# Altium schematic sheet RS485 Outputs.SchDoc: RS485 Outputs
size 292 x 193 mm; SheetNumber: 17; SheetTotal: 38
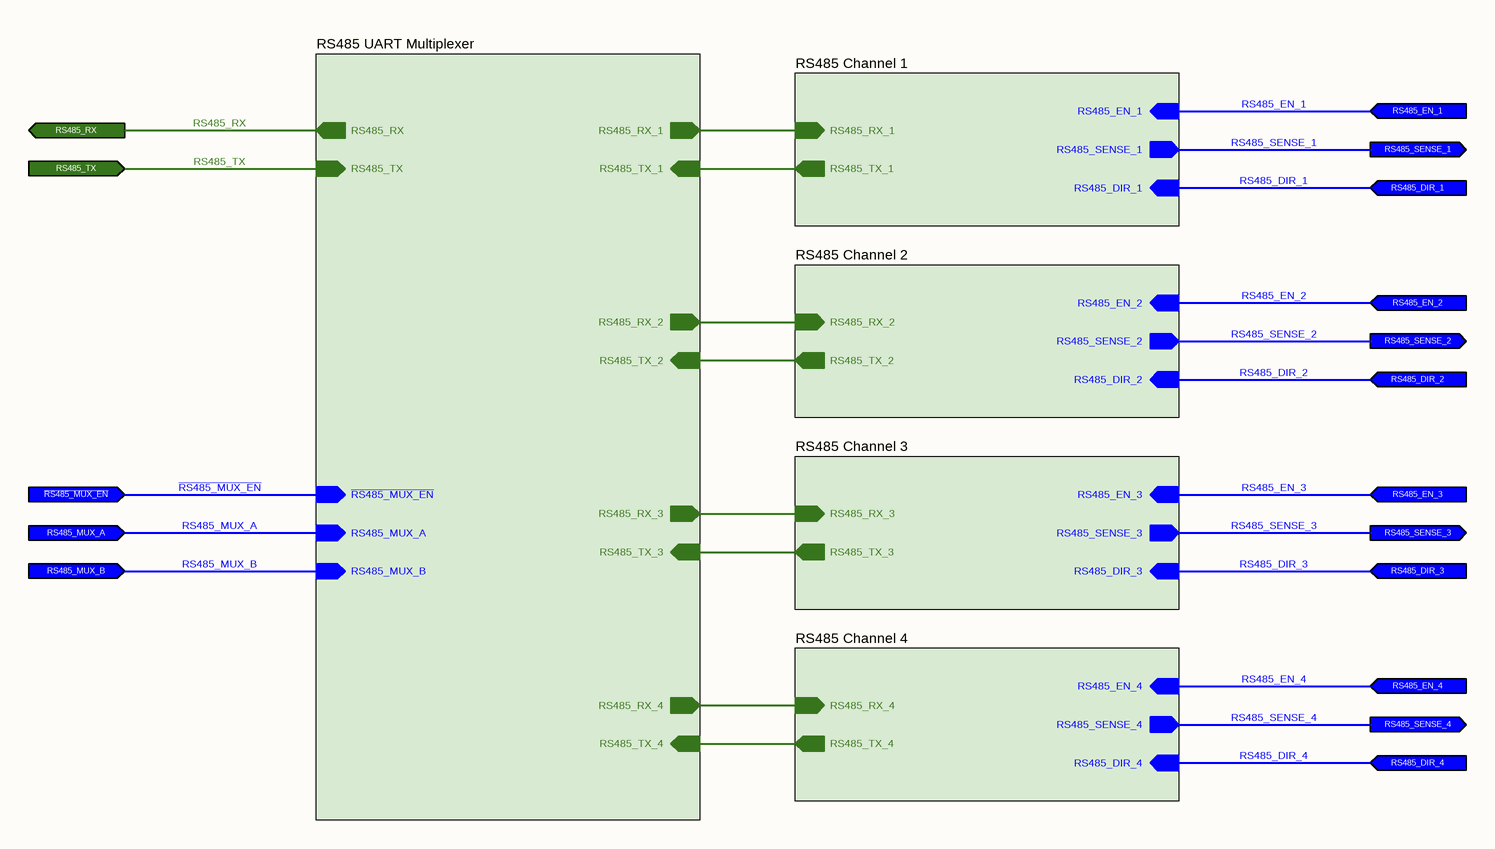
[diagram p0: RS485 Outputs.SchDoc]

## Sub-sheets
RS485 Channel 1 = RS485 Channel 1.SchDoc: RS485_TX_1 (out), RS485_RX_1 (in), RS485_EN_1 (in), RS485_SENSE_1 (out), RS485_DIR_1 (in)
RS485 Channel 2 = RS485 Channel 2.SchDoc: RS485_TX_2 (out), RS485_RX_2 (in), RS485_EN_2 (in), RS485_SENSE_2 (out), RS485_DIR_2 (in)
RS485 Channel 3 = RS485 Channel 3.SchDoc: RS485_TX_3 (out), RS485_RX_3 (in), RS485_EN_3 (in), RS485_SENSE_3 (out), RS485_DIR_3 (in)
RS485 Channel 4 = RS485 Channel 4.SchDoc: RS485_TX_4 (out), RS485_RX_4 (in), RS485_EN_4 (in), RS485_SENSE_4 (out), RS485_DIR_4 (in)
RS485 UART Multiplexer = RS485 UART Multiplexer.SchDoc: RS485_TX_1 (in), RS485_TX_3 (in), RS485_RX_2 (out), RS485_MUX_A (in), RS485_TX_2 (in), RS485_MUX_B (in), RS485_RX_1 (out), ~{RS485_MUX_EN} (in), RS485_TX (in), RS485_RX_3 (out), RS485_RX (out), RS485_RX_4 (out), RS485_TX_4 (in)

## Ports
RS485_DIR_1 (in), RS485_DIR_2 (in), RS485_DIR_3 (in), RS485_DIR_4 (in), RS485_EN_1 (in), RS485_EN_2 (in), RS485_EN_3 (in), RS485_EN_4 (in), RS485_MUX_A (in), RS485_MUX_B (in), RS485_RX (out), RS485_SENSE_1 (out), RS485_SENSE_2 (out), RS485_SENSE_3 (out), RS485_SENSE_4 (out), RS485_TX (in), ~{RS485_MUX_EN} (in)

## Nets
~{RS485_MUX_EN}: port ~{RS485_MUX_EN}, sheet RS485 UART Multiplexer/~{RS485_MUX_EN}
RS485_DIR_1: port RS485_DIR_1, sheet RS485 Channel 1/RS485_DIR_1
RS485_DIR_2: port RS485_DIR_2, sheet RS485 Channel 2/RS485_DIR_2
RS485_DIR_3: port RS485_DIR_3, sheet RS485 Channel 3/RS485_DIR_3
RS485_DIR_4: port RS485_DIR_4, sheet RS485 Channel 4/RS485_DIR_4
RS485_EN_1: port RS485_EN_1, sheet RS485 Channel 1/RS485_EN_1
RS485_EN_2: port RS485_EN_2, sheet RS485 Channel 2/RS485_EN_2
RS485_EN_3: port RS485_EN_3, sheet RS485 Channel 3/RS485_EN_3
RS485_EN_4: port RS485_EN_4, sheet RS485 Channel 4/RS485_EN_4
RS485_MUX_A: port RS485_MUX_A, sheet RS485 UART Multiplexer/RS485_MUX_A
RS485_MUX_B: port RS485_MUX_B, sheet RS485 UART Multiplexer/RS485_MUX_B
RS485_RX: port RS485_RX, sheet RS485 UART Multiplexer/RS485_RX
RS485_SENSE_1: port RS485_SENSE_1, sheet RS485 Channel 1/RS485_SENSE_1
RS485_SENSE_2: port RS485_SENSE_2, sheet RS485 Channel 2/RS485_SENSE_2
RS485_SENSE_3: port RS485_SENSE_3, sheet RS485 Channel 3/RS485_SENSE_3
RS485_SENSE_4: port RS485_SENSE_4, sheet RS485 Channel 4/RS485_SENSE_4
RS485_TX: port RS485_TX, sheet RS485 UART Multiplexer/RS485_TX
(unnamed): sheet RS485 Channel 1/RS485_TX_1, sheet RS485 UART Multiplexer/RS485_TX_1
(unnamed): sheet RS485 Channel 1/RS485_RX_1, sheet RS485 UART Multiplexer/RS485_RX_1
(unnamed): sheet RS485 Channel 2/RS485_TX_2, sheet RS485 UART Multiplexer/RS485_TX_2
(unnamed): sheet RS485 Channel 2/RS485_RX_2, sheet RS485 UART Multiplexer/RS485_RX_2
(unnamed): sheet RS485 Channel 3/RS485_TX_3, sheet RS485 UART Multiplexer/RS485_TX_3
(unnamed): sheet RS485 Channel 3/RS485_RX_3, sheet RS485 UART Multiplexer/RS485_RX_3
(unnamed): sheet RS485 Channel 4/RS485_TX_4, sheet RS485 UART Multiplexer/RS485_TX_4
(unnamed): sheet RS485 Channel 4/RS485_RX_4, sheet RS485 UART Multiplexer/RS485_RX_4

## Notes on the sheet
- © 2021 All rights reserved.
  This document may not, in whole or in part, be copied, photocopied, reproduced, translated or converted to any electronic or machine readable from without prior written permission of Mehmet Günce Akkoyun.
  Engineer contact : akkoyun@me.com
- Property of
- Engineer :
- Date :
- Size :
- A4
- Time :
- Project :
- Page :
- /
- Customer :
- Product ID :
- Module ID :
- Version :
- File :
- Revision :